# EAGLE design CircuitDiagram (EAGLE 9.3.0)
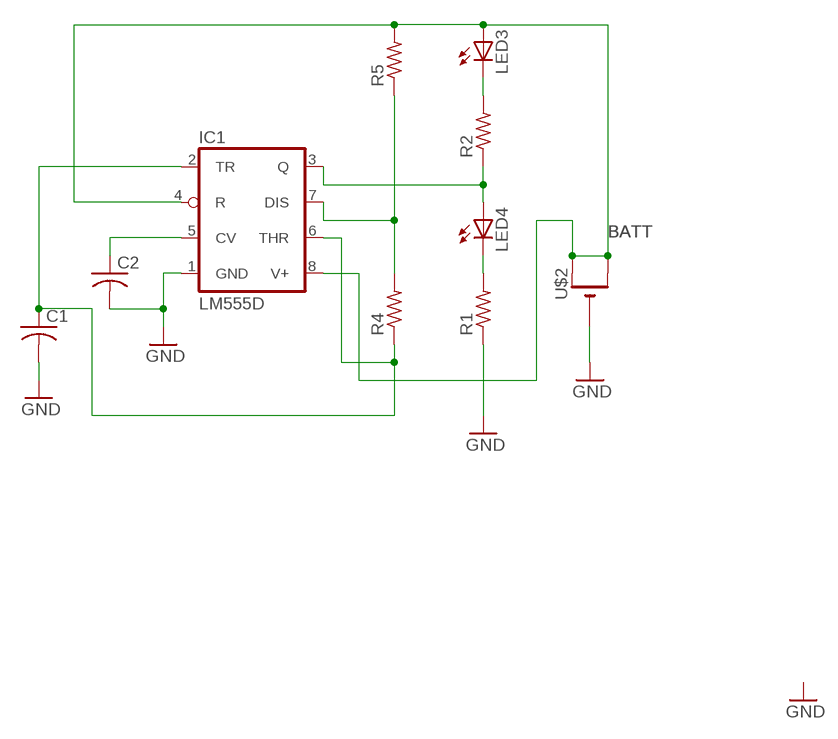
[diagram p0: schematic, sheet 1]

## Parts
C1  C-USC0805  [C0805]
C2  C-USC0805  [C0805]
IC1  LM555D  [SO08]
LED3  LEDCHIP-LED0805  [CHIP-LED0805]
LED4  LEDCHIP-LED0805  [CHIP-LED0805]
R1  R-US_R0805  [R0805]
R2  R-US_R0805  [R0805]
R4  R-US_R0805  [R0805]
R5  R-US_R0805  [R0805]
U$2  CR1220SMT  [CR1220-SMD]

## Nets
BATT: IC1.4(R) IC1.8(V+) LED3.A R5.2 U$2.+$1(+) U$2.+$2(+1)
GND: C1.2 C2.2 IC1.1(GND) R1.1 U$2.-
N$2: LED4.C R1.2
N$3: IC1.3(Q) LED4.A R2.1
N$4: LED3.C R2.2
N$6: IC1.7(DIS) R4.2 R5.1
N$7: C2.1 IC1.5(CV)
N$8: C1.1 IC1.2(TR) IC1.6(THR) R4.1

## Library data of the parts
C1 C2 = adafruit:C-US: CAPACITOR, American symbol
IC1 = adafruit:*555: TIMER Changed DIP package to have round (not oval) pin pads http://www.ladyada.net/library/pcb/eaglelibrary.html
LED3 LED4 = adafruit:LED: LED OSRAM: - CHIPLED LG R971, LG N971, LY N971, LG Q971, LY Q971, LO R971, LY R971 LH N974, LH R974 LS Q976, LO Q976, LY Q976 LO Q996 - Hyper CHIPLED LW Q18S LB Q993, LB Q99A, LB R99A - SideLED LS A670, LO A670, LY A670, LG A670, LP A670 LB A673, LV A673, LT A673, LW A673 LH A674 LY A675 LS A676, LA A676, LO A676, LY A676, LW A676 LS A679, LY A679, LG A679 - Hyper Micro SIDELED® LS Y876, LA Y876, LO Y876, LY Y876 LT Y87S - SmartLED LW L88C, LW L88S LB L89C, LB L89S, LG L890 LS L89K, LO L89K, LY L89K LS L896, LA L896, LO L896, LY L896 - TOPLED LS T670, LO T670, LY T670, LG T670, LP T670 LSG T670, LSP T670, LSY T670, LOP T670, LYG T670 LG T671, LOG T671, LSG T671 LB T673, LV T673, LT T673, LW T673 LH T674 LS T676, LA T676, LO T676, LY T676, LB T676, LH T676, LSB T676, LW T676 LB T67C, LV T67C, LT T67C, LS T67K, LO T67K, LY T67K, LW E67C LS E67B, LA E67B, LO E67B, LY E67B, LB E67C, LV E67C, LT E67C LW T67C LS T679, LY T679, LG T679 LS T770, LO T770, LY T770, LG T770, LP T770 LB T773, LV T773, LT T773, LW T773 LH T774 LS E675, LA E675, LY E675, LS T675 LS T776, LA T776, LO T776, LY T776, LB T776 LHGB T686 LT T68C, LB T68C - Hyper Mini TOPLED® LB M676 - Mini TOPLED Santana® LG M470 LS M47K, LO M47K, LY M47K Source: http://www.osram.convergy.de/
R1 R2 R4 R5 = adafruit:R-US_: RESISTOR, American symbol
U$2 = adafruit:CR1220: CR1216/CR1220/CR1225 12mm 3V lithium coin cell Great for battery packup. Both SMT and THM holders. Note the THM package has the ground pads on both sides of the PCB so that the masks are the same - this reduces the cost

## Board
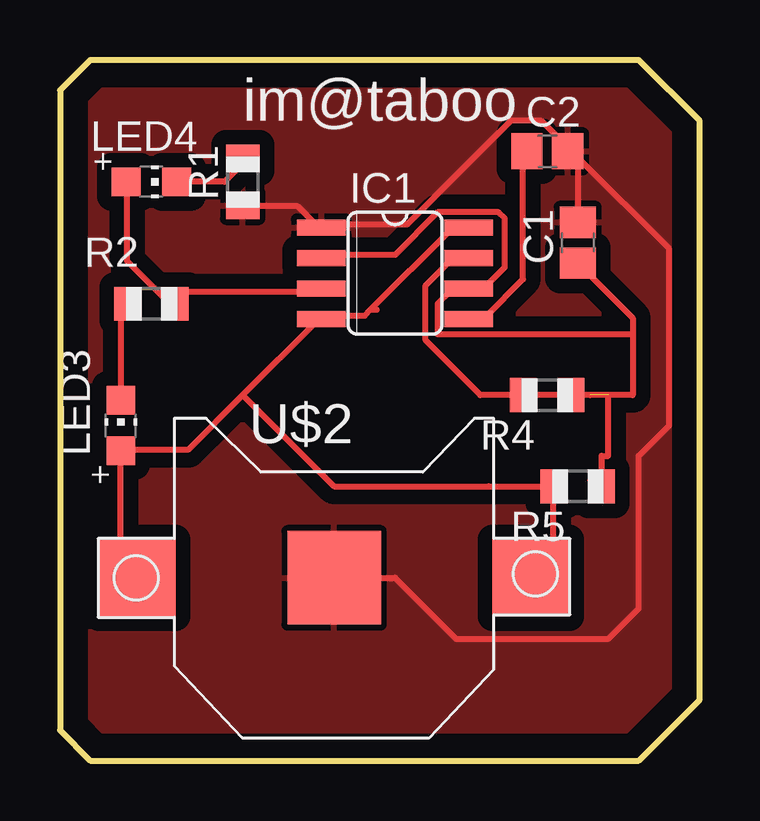
[diagram p1: board, top side]

Size 26.67 x 29.21 mm. Coordinates in mm from the lower left corner, seen from the top.
Outline: 0,27.94 0,1.27 1.27,0 24.13,0 26.67,2.54 26.67,26.67 24.13,29.21 1.27,29.21 0,27.94
Copper layers (1*16): Top 0.035mm / dielectric 1.5mm / Bottom 0.035mm
Design rules "default *": minimum track width 10mil, minimum drill 0.35mm, track to track 10mil, track to pad 6mil, pad to pad 6mil, via to via 6mil, smd to smd 6mil, copper to edge 40mil, drill to drill 6mil, minimum pad ring 10mil, minimum via ring 8mil, stop-mask expansion 4mil, vias tented up to drill 0mil, thermal gap 10mil

### Footprints (pad centres in the part's own frame; a part is rotated, then mirrored left to right if it is on the bottom)
C0805 = smd 1.3 x 1.5: 1 -0.85,0; 2 0.85,0
SO08 = smd 0.66 x 2.032: 1 -1.905,-3.073; 2 -0.635,-3.073; 3 0.635,-3.073; 4 1.905,-3.073; 5 1.905,3.073; 6 0.635,3.073; 7 -0.635,3.073; 8 -1.905,3.073
CHIP-LED0805 = smd 1.2 x 1.2: A 0,-1.05; C 0,1.05
R0805 = smd 1.1 x 1.4: 1 -1,0; 2 1,0
CR1220-SMD = smd 3.2 x 3.2: +$1 -8.2,0; +$2 8.2,0 | smd 3.9 x 3.9: - 0,0

### Placement (x,y rotation side)
C1  21.59,21.59 90 top
C2  20.32,25.4 0 top
IC1  13.97,20.32 270 top
LED3  2.54,13.97 0 top
LED4  3.81,24.13 270 top
R1  7.62,24.13 90 top
R2  3.81,19.05 180 top
R4  20.32,15.24 180 top
R5  21.59,11.43 180 top
U$2  11.43,7.62 0 top

### Tracks (layer width: path | path; a pad name or v marks a point on that pad's centre or on a via)
BATT
  Top 0.254: U$2.+$1 3.05,7.62 2.54,8.13 LED3.A 2.54,12.95 5.33,12.95 7.62,15.24 | 20.57,11.43 20.57,8.38 19.81,7.62 U$2.+$2 | 12.95,18.8 16.26,22.1 17.02,22.1 IC1.8 | 12.95,18.8 12.7,18.54 10.92,18.54 IC1.4 10.67,18.29 7.62,15.24 | 12.95,18.8 13.21,18.8 | 20.57,11.43 R5.2 | 20.57,11.43 17.88,11.43 11.43,11.43 7.62,15.24
GND
  Top 0.254: R1.1 7.62,23.11 9.91,23.11 10.67,22.35 IC1.1 10.92,22.35 14.48,22.35 18.8,26.67 20.07,26.67 21.34,25.4 | 21.59,25.15 21.34,25.4 | 21.34,25.4 C2.2 | 21.59,25.15 C1.2 | U$2.- 13.97,7.62 16.51,5.08 22.86,5.08 24.13,6.35 24.13,12.7 25.4,13.97 25.4,21.34 21.59,25.15
  pour Top (isolate 0.61): 0,27.94 1.27,29.21 24.13,29.21 26.67,26.67 26.67,2.54 24.13,0 1.27,0 0,0
N$2
  Top 0.254: LED4.C 6.86,24.13 7.62,24.89 R1.2
N$3
  Top 0.254: LED4.A 2.79,24.13 2.79,20.83 4.57,19.05 R2.1 4.83,19.05 5.33,19.56 10.67,19.56 IC1.3
N$4
  Top 0.254: LED3.C 2.54,18.8 2.79,19.05 R2.2
N$6  (1 unrouted)
  Top 0.254: 22.1,11.68 22.35,11.43 R5.1 22.59,12.7 22.86,12.7 22.86,15.24 | 22.1,15.24 R4.2 17.53,15.24 15.24,17.53 15.24,19.81 16.26,20.83 17.02,20.83 IC1.7
N$7
  Top 0.254: C2.1 19.3,25.4 19.3,20.07 17.78,18.54 17.27,18.54 IC1.5
N$8
  Top 0.254: 23.88,17.78 23.88,15.24 R4.1 | C1.1 23.88,18.45 23.88,17.78 | IC1.2 10.92,21.08 13.97,21.08 15.75,22.86 18.29,22.86 18.54,22.61 18.54,20.57 17.78,19.81 17.27,19.81 IC1.6 17.02,19.56 16.26,19.56 15.75,19.05 15.75,17.78 23.88,17.78

### Text on the board
tPlace: im@taboo